# Altium project PMV2_IBV1_Altium.PrjPCB
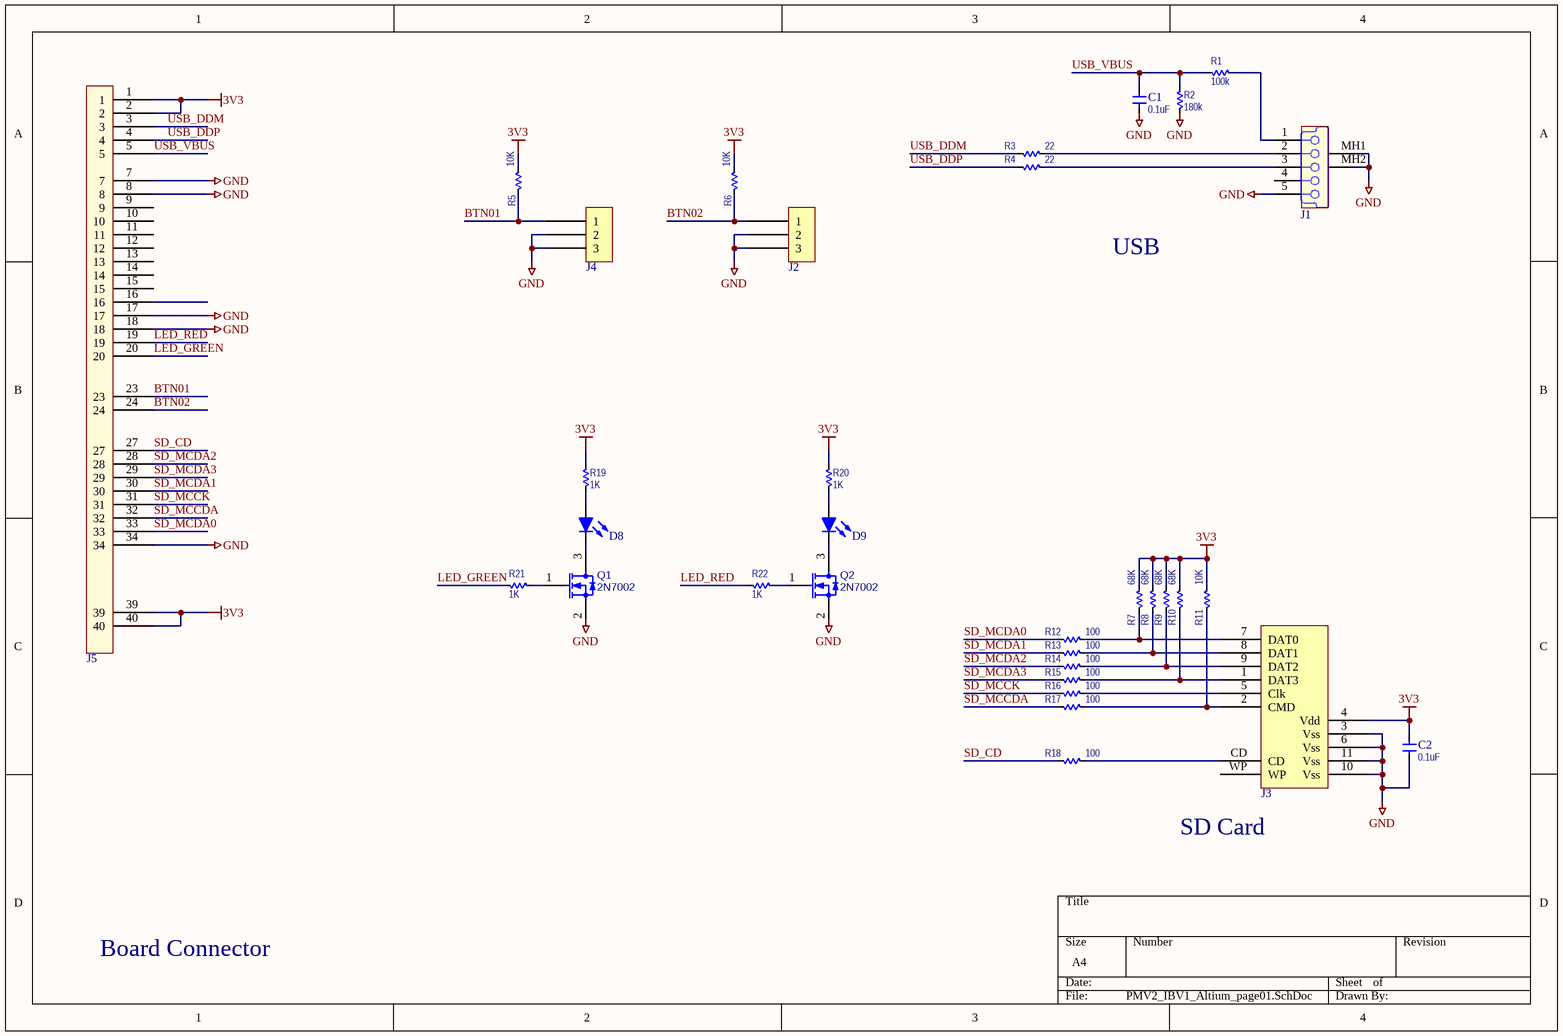
[diagram p0: PMV2_IBV1_Altium_page01.SchDoc]
1 sheet, 33 parts. Net scope: global (net labels, ports and power ports of the same name join across sheets).
Board file: PMV2_IBV1_Altium.PcbDoc

## Sheet PMV2_IBV1_Altium_page01.SchDoc
size A4

### Parts
C1  value 0.1uF  [CAPC3216X135N_B]  (hidden comment: CAP_C1206F104K3RACTU_KEMET)
C2  value 0.1uF  [CAPC3216X135N_B]  (hidden comment: CAP_C1206F104K3RACTU_KEMET)
D8  DIO_LED  [Led]  (value not drawn)
D9  DIO_LED  [Led]  (value not drawn)
J1  CON_MINI_USB  [UBS MiniB]  (value not drawn)
J2  MSC_Switch  [SW_FSMRA3JH]  (value not drawn)
J3  CON_SD_Socket  [SD CARD SOCKET]  (value not drawn)
J4  MSC_Switch  [SW_FSMRA3JH]  (value not drawn)
J5  CON_Header_2x30_PMV2  [HeaderX70b]  (value not drawn)
Q1  2N7002  [SOT23-3M]
Q2  2N7002  [SOT23-3M]
R1  value 100k  [RESC3216N]  (hidden comment: RES_RC1206JR-07100KL_YAGEO)
R2  value 180k  [RESC3216N]  (hidden comment: RES_RC1206JR-07180KL_YAGEO)
R3  value 22  [RESC3216N]  (hidden comment: RES_RC1206JR-0722RL_YAGEO)
R4  value 22  [RESC3216N]  (hidden comment: RES_RC1206JR-0722RL_YAGEO)
R5  value 10K  [RESC3216N]  (hidden comment: RES_RC1206FR-0710KL_Yageo)
R6  value 10K  [RESC3216N]  (hidden comment: RES_RC1206FR-0710KL_Yageo)
R7  value 68K  [RESC3216N]  (hidden comment: RES_RC1206JR-0768KL_Yageo)
R8  value 68K  [RESC3216N]  (hidden comment: RES_RC1206JR-0768KL_Yageo)
R9  value 68K  [RESC3216N]  (hidden comment: RES_RC1206JR-0768KL_Yageo)
R10  value 68K  [RESC3216N]  (hidden comment: RES_RC1206JR-0768KL_Yageo)
R11  value 10K  [RESC3216N]  (hidden comment: RES_RC1206FR-0710KL_Yageo)
R12  value 100  [RESC3216N]  (hidden comment: RES_RC1206JR-07100RL_Yageo)
R13  value 100  [RESC3216N]  (hidden comment: RES_RC1206JR-07100RL_Yageo)
R14  value 100  [RESC3216N]  (hidden comment: RES_RC1206JR-07100RL_Yageo)
R15  value 100  [RESC3216N]  (hidden comment: RES_RC1206JR-07100RL_Yageo)
R16  value 100  [RESC3216N]  (hidden comment: RES_RC1206JR-07100RL_Yageo)
R17  value 100  [RESC3216N]  (hidden comment: RES_RC1206JR-07100RL_Yageo)
R18  value 100  [RESC3216N]  (hidden comment: RES_RC1206JR-07100RL_Yageo)
R19  value 1K  [RESC3216N]  (hidden comment: RES_RC1206FR-071KL_Yageo)
R20  value 1K  [RESC3216N]  (hidden comment: RES_RC1206FR-071KL_Yageo)
R21  value 1K  [RESC3216N]  (hidden comment: RES_RC1206FR-071KL_Yageo)
R22  value 1K  [RESC3216N]  (hidden comment: RES_RC1206FR-071KL_Yageo)

### Nets
3V3: C2.1(T1) J3.4(Vdd) J5.1 J5.2 J5.39 J5.40 R5.2(T2) R6.2(T2) R7.2(T2) R8.2(T2) R9.2(T2) R10.2(T2) R11.2(T2) R19.2(T2) R20.2(T2)
GND: C1.2(T2) C2.2(T2) J1.5 J1.MH1 J1.MH2 J2.2 J2.3 J3.3(Vss) J3.6(Vss) J3.10(Vss) J3.11(Vss) J4.2 J4.3 J5.7 J5.8 J5.17 J5.18 J5.34 Q1.2(S) Q2.2(S) R2.2(T2)
BTN01: J4.1 J5.23 R5.1(T1)
BTN02: J2.1 J5.24 R6.1(T1)
LED_GREEN: J5.20 R21.2(T2)
LED_RED: J5.19 R22.2(T2)
SD_CD: J5.27 R18.2(T2)
SD_MCCDA: J5.32 R17.2(T2)
SD_MCCK: J5.31 R16.2(T2)
SD_MCDA0: J5.33 R12.2(T2)
SD_MCDA1: J5.30 R13.2(T2)
SD_MCDA2: J5.28 R14.2(T2)
SD_MCDA3: J5.29 R15.2(T2)
USB_DDM: J5.3 R3.2(T2)
USB_DDP: J5.4 R4.2(T2)
USB_VBUS: C1.1(T1) J5.5 R1.2(T2) R2.1(T1)
NetD8_1: D8.1(A) R19.1(T1)
NetD8_2: D8.2(K) Q1.3(D)
NetD9_1: D9.1(A) R20.1(T1)
NetD9_2: D9.2(K) Q2.3(D)
NetJ1_1: J1.1 R1.1(T1)
NetJ1_2: J1.2 R3.1(T1)
NetJ1_3: J1.3 R4.1(T1)
NetJ3_1: J3.1(DAT3) R10.1(T1) R15.1(T1)
NetJ3_2: J3.2(CMD) R11.1(T1) R17.1(T1)
NetJ3_5: J3.5(Clk) R16.1(T1)
NetJ3_7: J3.7(DAT0) R7.1(T1) R12.1(T1)
NetJ3_8: J3.8(DAT1) R8.1(T1) R13.1(T1)
NetJ3_9: J3.9(DAT2) R9.1(T1) R14.1(T1)
NetJ3_CD: J3.CD R18.1(T1)
NetQ1_1: Q1.1(G) R21.1(T1)
NetQ2_1: Q2.1(G) R22.1(T1)

Not connected (* = marked no-connect by the designer): J1 4; J3 WP; J5 9 10 11 12 13 14 15 16

### Notes on the sheet
- USB
- (near J3) SD Card
- Board Connector

### Library data of the parts
C1 C2 = CAP_C1206F104K3RACTU_KEMET: CAP CER 0.1UF 25V X7R 1206; Manufacturer: Kemet; Tolerance: 5%; Digikey Part Number: 399-5615-1-ND; Supplier: *; Power Rating: *; Voltage Rating: 25V; BOM Populate: *; Mouser Part Number: 80-C1206F104K3R; Manufacturer Part Number: C1206F104K3RACTU
D8 D9 = DIO_LED: Diode Led; Published: 8-Jun-2000; LatestRevisionDate: 08-Jul-2005; LatestRevisionNote: Mech Layer 1 removed.; PackageReference: LED-0; Publisher: Altium Limited
J1 = CON_MINI_USB: Manufacturer Part Number: UX60SC-MB-5S8; Digikey Part Number: H11589CT-ND; Mouser Part Number: 798-UX60SC-MB-5S8
J3 = CON_SD_Socket: SD Socket; Manufacturer Part Number: 10067847-001RLF; Digikey Part Number: 609-3956-1-ND; Mouser Part Number: 649-10067847-001RLF
Q1 Q2 = Q_2N7002-7-F_DIODES: MOSFET N-CH 60V 115MA SOT23-3; Manufacturer Part Number: 2N7002-FDICT-ND; Mouser Part Number: 621-2N7002-F; Voltage Rating: 60V; Digikey Part Number: 2N7002-7-F; Value: 2N7002
R1 = RES_RC1206JR-07100KL_YAGEO: RES SMD 100K OHM 5% 1/4W 1206; Manufacturer: YAGEO; BOM Populate: *; Digikey Part Number: 311-100KERCT-ND; Power Rating: 1/4W; Manufacturer Part Number: RC1206JR-07100KL; Mouser Part Number: 603-RC1206JR-07100KL; Tolerance: 5%
R2 = RES_RC1206JR-07180KL_YAGEO: RES SMD 180K OHM 5% 1/4W 1206; Manufacturer: YAGEO; BOM Populate: *; Digikey Part Number: 311-180KERCT-ND; Power Rating: 1/4W; Manufacturer Part Number: RC1206JR-07180KL; Mouser Part Number: 603-RC1206JR-07180KL; Tolerance: 5%
R3 R4 = RES_RC1206JR-0722RL_YAGEO: RES SMD 22 OHM 5% 1/4W 1206; Manufacturer: YAGEO; BOM Populate: *; Digikey Part Number: 311-22ERCT-ND; Power Rating: 1/4W; Manufacturer Part Number: RC1206JR-0722RL; Mouser Part Number: 603-RC1206JR-0722RL; Tolerance: 5%
R5 R6 R11 = RES_RC1206FR-0710KL_Yageo: RES SMD 10K OHM 1% 1/4W 1206; Manufacturer: Yageo; BOM Populate: *; Supplier Part No: *; Supplier: *; Tolerance: 1%; Digikey Part Number: 311-10.0KFRCT-ND; Power Rating: 1/4W; Manufacturer Part Number: RC1206FR-0710KL; Mouser Part Number: 603-RC1206FR-0710KL
R7-R10 = RES_RC1206JR-0768KL_Yageo: RES SMD 68K OHM 5% 1/4W 1206; Manufacturer: Yageo; BOM Populate: *; Supplier Part No: *; Supplier: *; Tolerance: 5%; Digikey Part Number: 311-68KERCT-ND; Power Rating: 1/4W; Manufacturer Part Number: RC1206JR-0768KL; Mouser Part Number: 603-RC1206JR-0768KL
R12-R18 = RES_RC1206JR-07100RL_Yageo: RES SMD 100 OHM 5% 1/4W 1206; Manufacturer: Yageo; BOM Populate: *; Supplier Part No: *; Supplier: *; Tolerance: 5%; Digikey Part Number: 311-100ERCT-ND; Power Rating: 1/4W; Manufacturer Part Number: RC1206JR-07100RL; Mouser Part Number: 603-RC1206JR-07100RL
R19-R22 = RES_RC1206FR-071KL_Yageo: RES SMD 1K OHM 1% 1/4W 1206; Manufacturer: Yageo; BOM Populate: *; Supplier Part No: *; Supplier: *; Tolerance: 1%; Digikey Part Number: 311-1.00KFRCT-ND; Power Rating: 1/4W; Manufacturer Part Number: RC1206FR-071KL; Mouser Part Number: 603-RC1206FR-071KL